# EAGLE design proto1 (EAGLE 9.4.1)
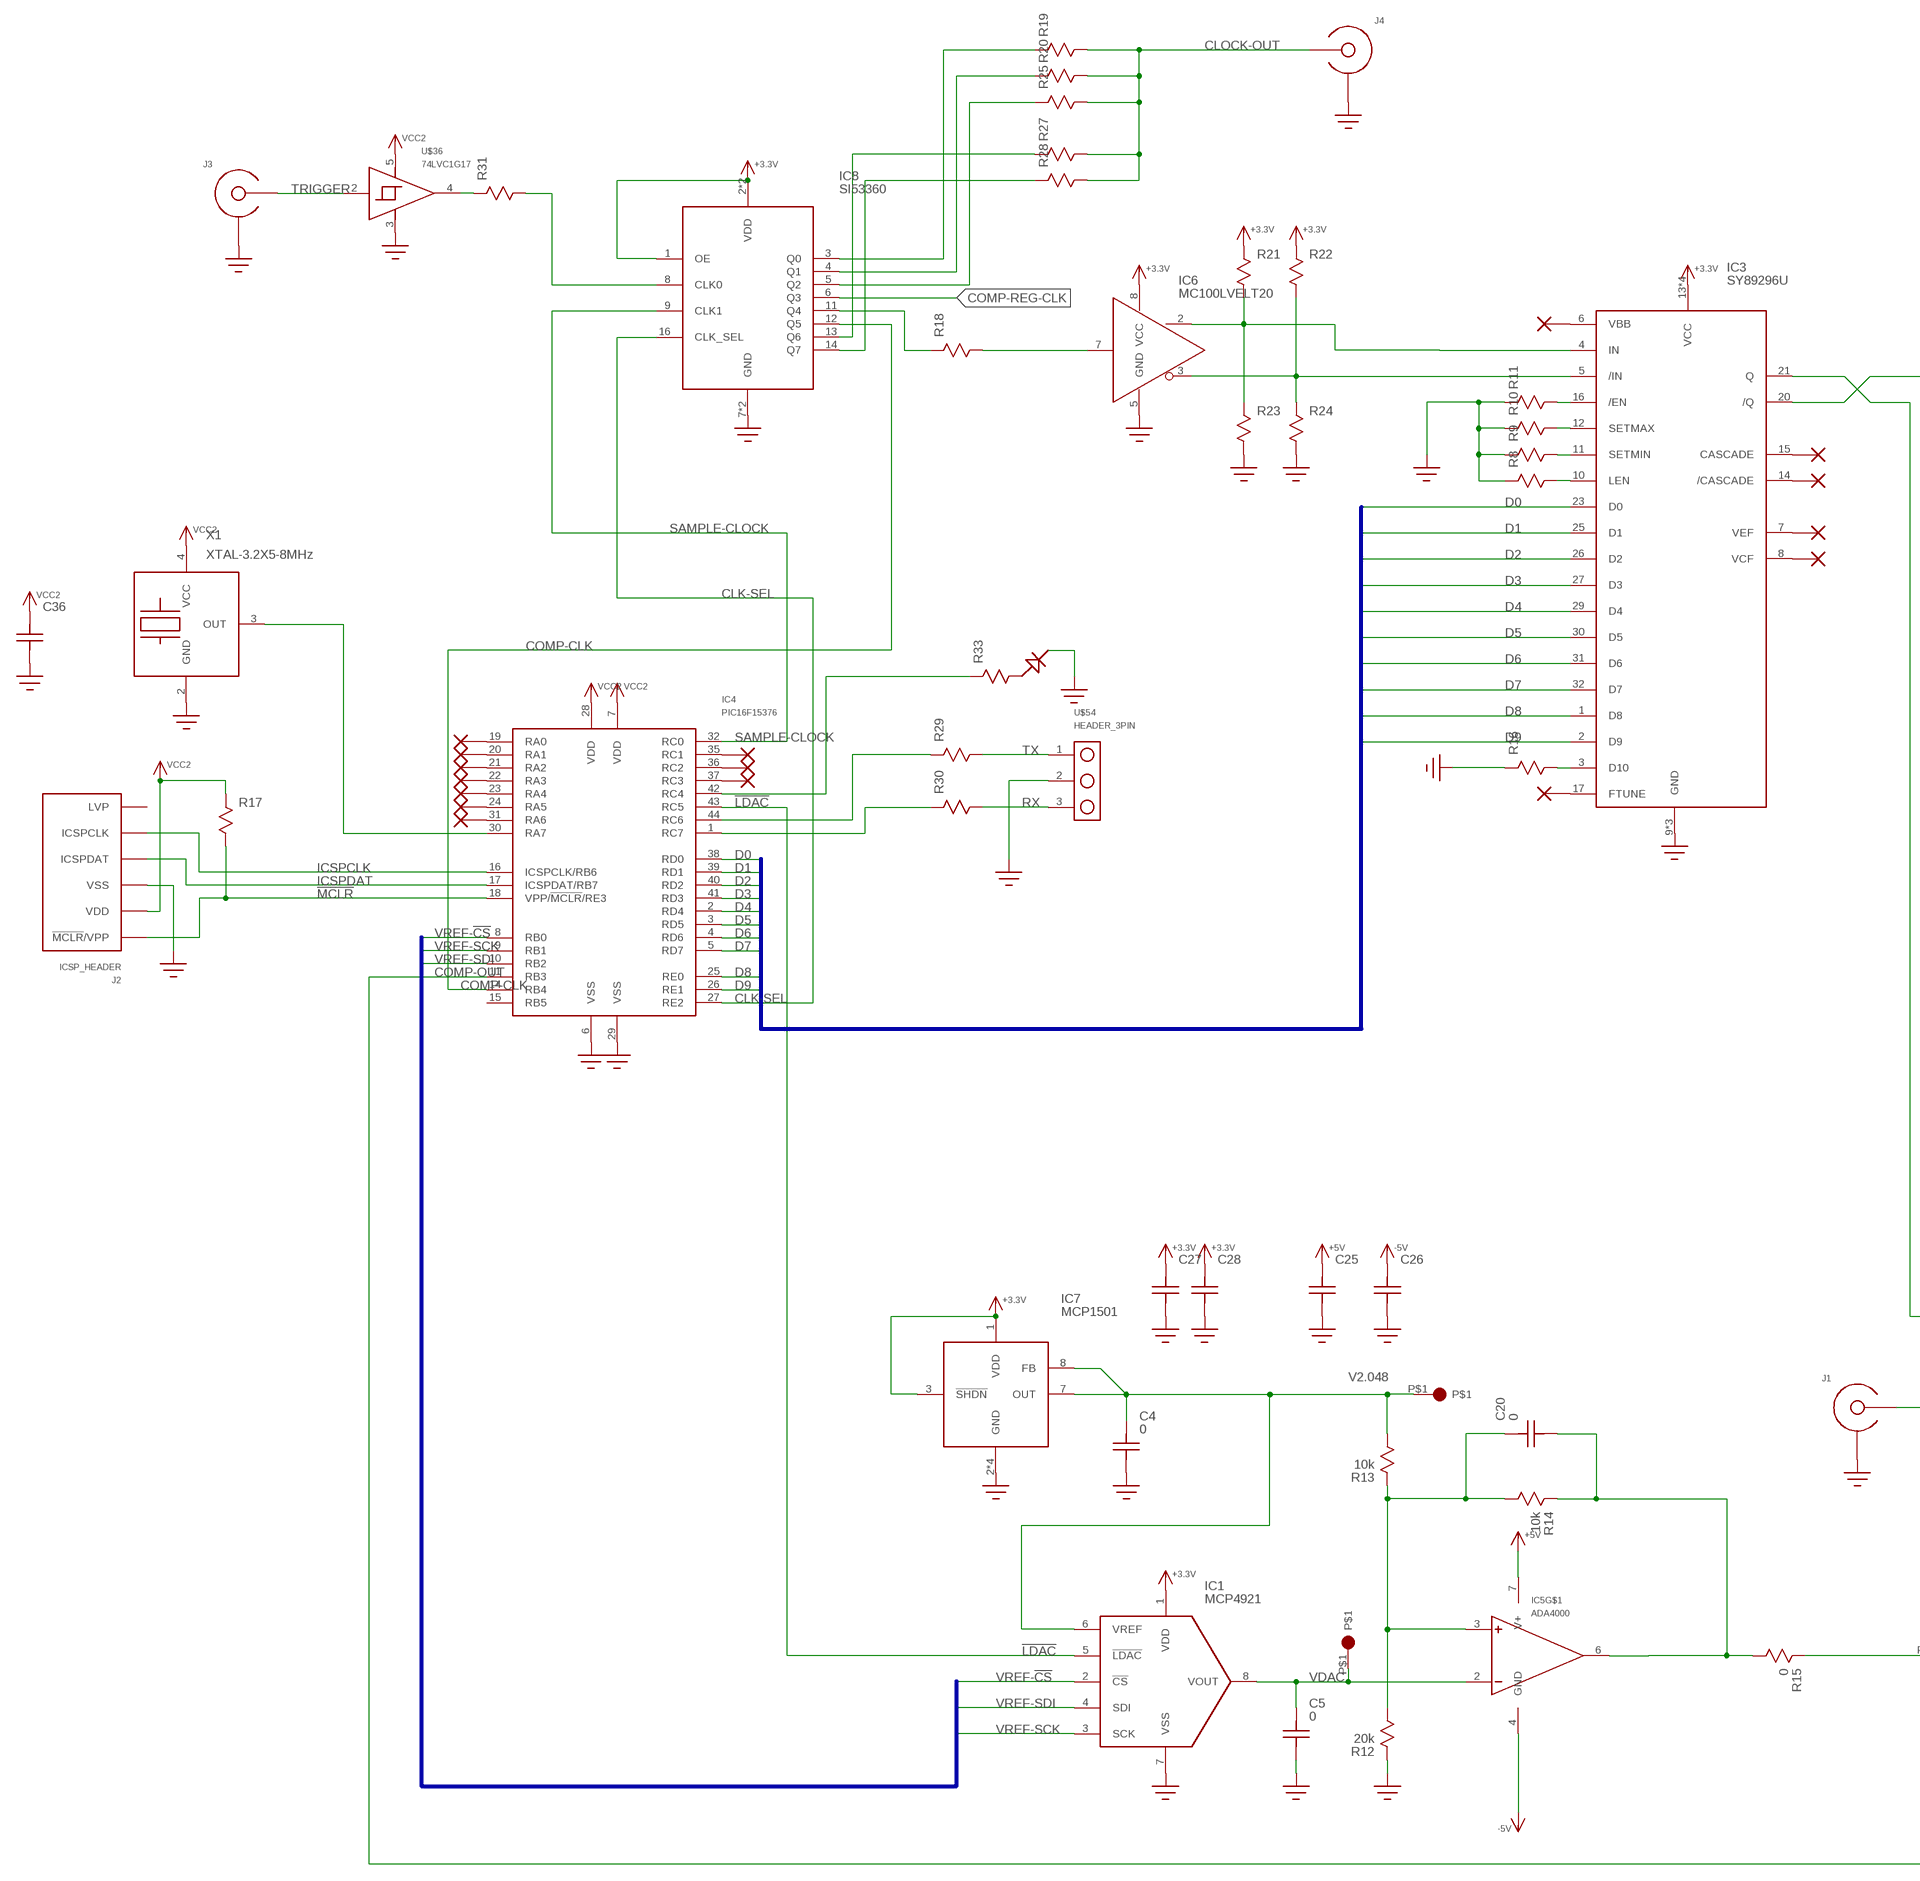
[diagram p0: schematic, sheet 1, part 1 of 2]
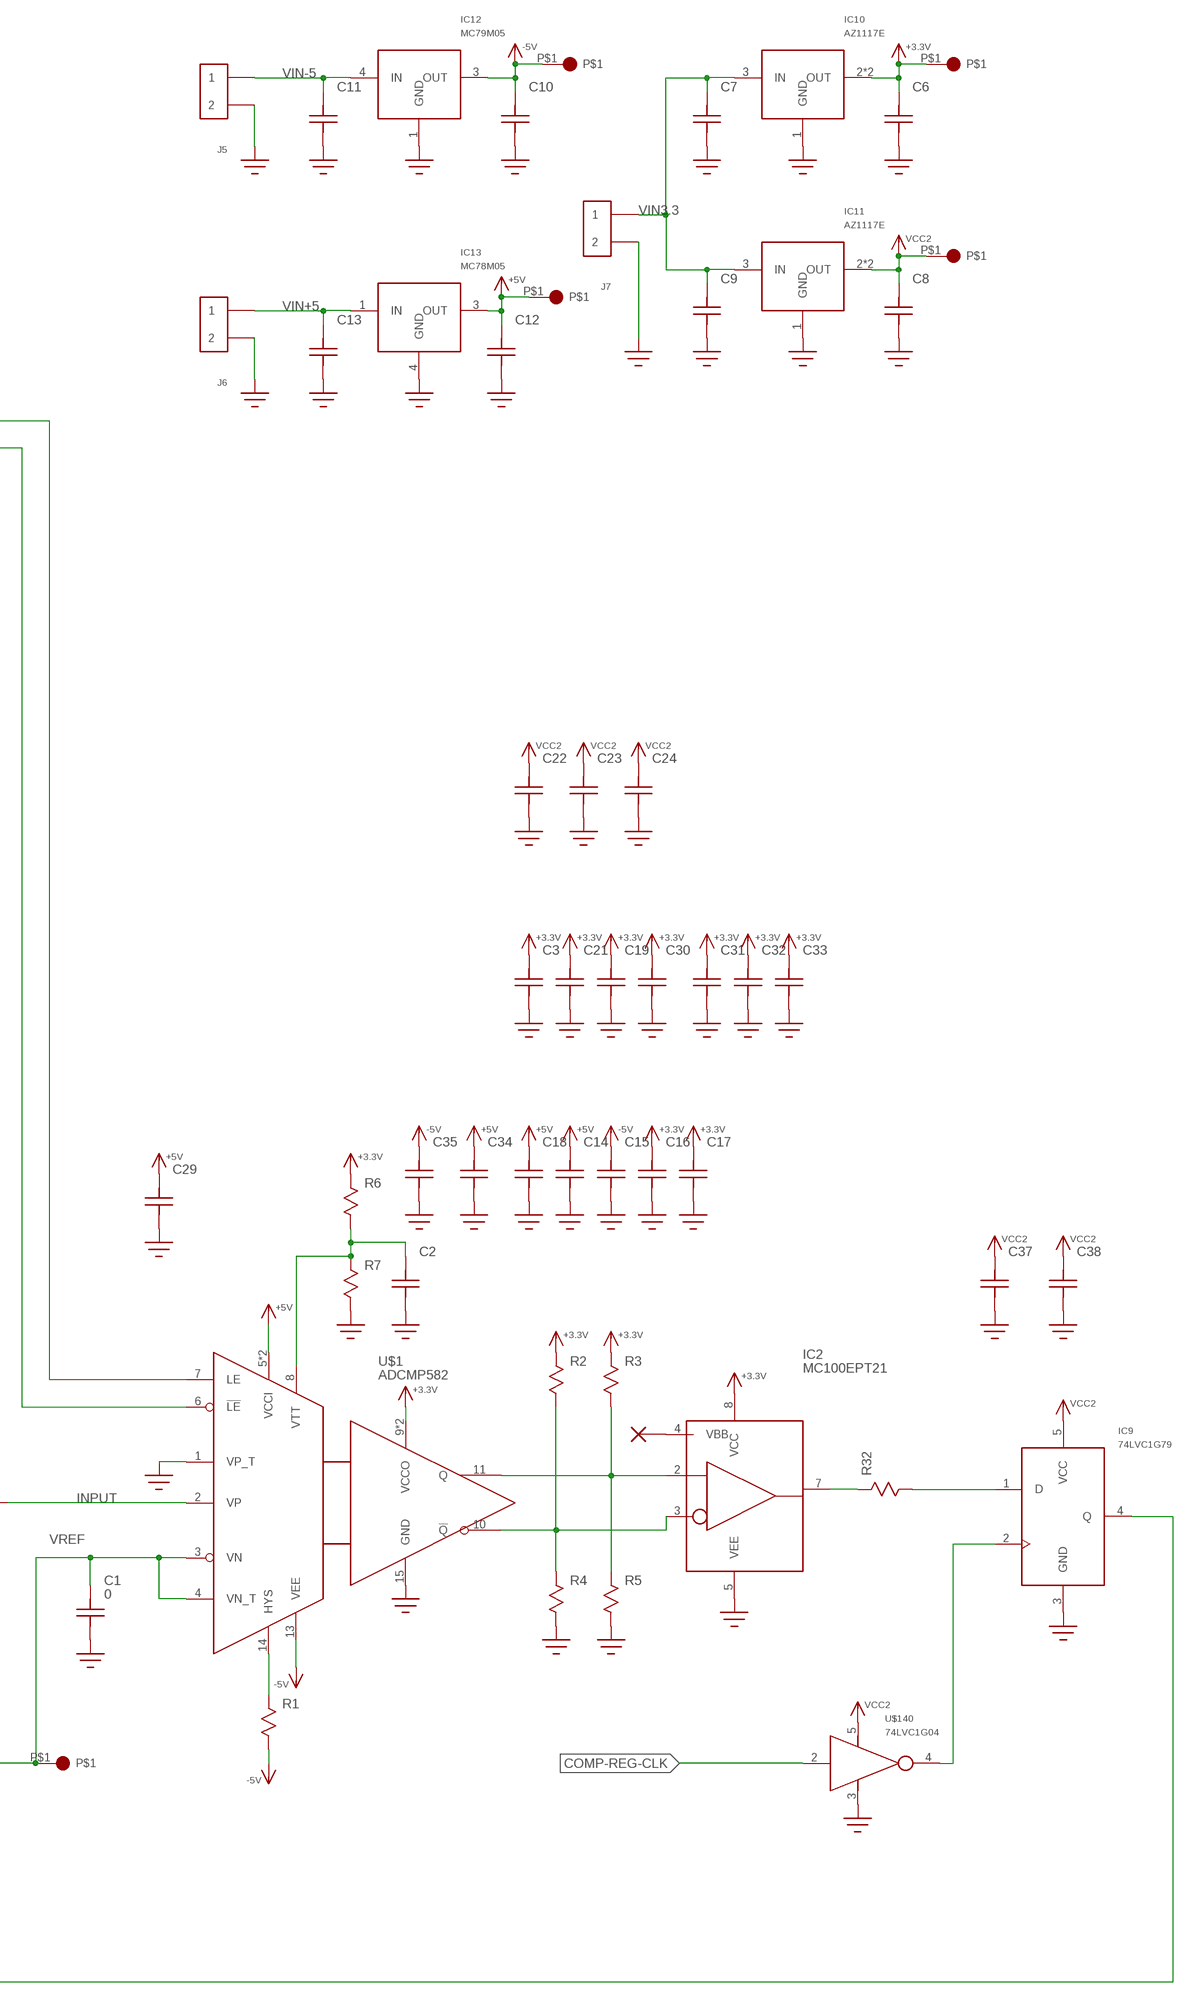
[diagram p1: schematic, sheet 1, part 2 of 2]

## Parts
C1  0  C0603  [C0603]
C2  C0402_NO_THERMALS  [C0402_NO_THERMALS]
C3  C0603  [C0603]
C4  0  C0603  [C0603]
C5  0  C0603  [C0603]
C6  C1206  [1206]
C7  C1206  [1206]
C8  C1206  [1206]
C9  C1206  [1206]
C10  C1206  [1206]
C11  C1206  [1206]
C12  C1206  [1206]
C13  C1206  [1206]
C14  C0402_NO_THERMALS  [C0402_NO_THERMALS]
C15  C0402_NO_THERMALS  [C0402_NO_THERMALS]
C16  C0402_NO_THERMALS  [C0402_NO_THERMALS]
C17  C0402_NO_THERMALS  [C0402_NO_THERMALS]
C18  C0402_NO_THERMALS  [C0402_NO_THERMALS]
C19  C0603  [C0603]
C20  0  C0603  [C0603]
C21  C0603  [C0603]
C22  C0603  [C0603]
C23  C0603  [C0603]
C24  C0603  [C0603]
C25  C0603  [C0603]
C26  C0603  [C0603]
C27  C0603  [C0603]
C28  C0603  [C0603]
C29  C1206  [1206]
C30  C0603  [C0603]
C31  C0603  [C0603]
C32  C0603  [C0603]
C33  C0603  [C0603]
C34  C0603  [C0603]
C35  C0603  [C0603]
C36  C0603  [C0603]
C37  C0603  [C0603]
C38  C0603  [C0603]
IC1  MCP4921  MCP49X1  [SOIC8]
IC2  MC100EPT21  [SOIC8]
IC3  SY89296U  [TQFP32_7X7]
IC4  PIC16F15376  [TQFP44]
IC5  ADA4000  [SOIC8]
IC6  MC100LVELT20  [SOIC8]
IC7  MCP1501  MCP1501SOIC8  [SOIC8]
IC8  SI53360  SI53360TSSOP16  [TSSOP16]
IC9  74LVC1G79  [SOT23-5]
IC10  AZ1117E  [SOT-223]
IC11  AZ1117E  [SOT-223]
IC12  MC79M05  MC79M00  [DPAK]
IC13  MC78M05  MC78M00  [DPAK]
J1  SMA-EDGE-LAUNCH4L-4020-TAPER-FIXED  [SMA_EDGE_LAUNCH_4L_4020_TAPER_FIXED]
J2  ICSP_HEADER  [HEADER_6PIN]
J3  SMA-EDGE-LAUNCH4L-4020-TAPER-FIXED  [SMA_EDGE_LAUNCH_4L_4020_TAPER_FIXED]
J4  SMA-EDGE-LAUNCH4L-4020-TAPER-FIXED  [SMA_EDGE_LAUNCH_4L_4020_TAPER_FIXED]
J5  HEADER_2PINSCREW-TERM  [FCI_20020316_SCREW_TERM_2P]
J6  HEADER_2PINSCREW-TERM  [FCI_20020316_SCREW_TERM_2P]
J7  HEADER_2PINSCREW-TERM  [FCI_20020316_SCREW_TERM_2P]
P1  ICSP_PAD  [ICSP_PAD]
P2  ICSP_PAD  [ICSP_PAD]
P3  ICSP_PAD  [ICSP_PAD]
P4  ICSP_PAD  [ICSP_PAD]
P5  ICSP_PAD  [ICSP_PAD]
P6  ICSP_PAD  [ICSP_PAD]
P7  ICSP_PAD  [ICSP_PAD]
R1  R0603  [R0603]
R2  R0603  [R0603]
R3  R0603  [R0603]
R4  R0603  [R0603]
R5  R0603  [R0603]
R6  R0603  [R0603]
R7  R0603  [R0603]
R8  R0402  [0402]
R9  R0402  [0402]
R10  R0402  [0402]
R11  R0402  [0402]
R12  20k  R0603  [R0603]
R13  10k  R0603  [R0603]
R14  10k  R0603  [R0603]
R15  0  R0603  [R0603]
R16  R0603  [R0603]
R17  R0603  [R0603]
R18  R0603  [R0603]
R19  R0402  [0402]
R20  R0402  [0402]
R21  R0603  [R0603]
R22  R0603  [R0603]
R23  R0603  [R0603]
R24  R0603  [R0603]
R25  R0402  [0402]
R27  R0402  [0402]
R28  R0402  [0402]
R29  R0603  [R0603]
R30  R0603  [R0603]
R31  R0603  [R0603]
R32  R0603  [R0603]
R33  R0603  [R0603]
U$1  ADCMP582  [TQFN16-EP]
U$24  NO_CONNECT  (no package)
U$25  NO_CONNECT  (no package)
U$26  NO_CONNECT  (no package)
U$27  NO_CONNECT  (no package)
U$28  NO_CONNECT  (no package)
U$29  NO_CONNECT  (no package)
U$36  74LVC1G17  [SOT23-5]
U$54  HEADER_3PIN  [HEADER_3PIN]
U$57  NO_CONNECT  (no package)
U$86  NO_CONNECT  (no package)
U$87  NO_CONNECT  (no package)
U$88  LED_0603  [LED_0603]
U$90  NO_CONNECT  (no package)
U$91  NO_CONNECT  (no package)
U$92  NO_CONNECT  (no package)
U$93  NO_CONNECT  (no package)
U$94  NO_CONNECT  (no package)
U$95  NO_CONNECT  (no package)
U$96  NO_CONNECT  (no package)
U$98  NO_CONNECT  (no package)
U$140  74LVC1G04  [SOT23-5]
X1  XTAL-3.2X5-8MHz  XTAL_OSC  [XTAL_3.2X5]

## Nets
!LDAC!: IC1.5(!LDAC!) IC4.43(RC5)
!MCLR!: IC4.18(VPP/!MCLR!/RE3) J2.1(!MCLR!/VPP) R17.P$2
+3.3V: C3.P$2 C6.P$2 C16.2 C17.2 C19.P$2 C21.P$2 C27.P$2 C28.P$2 C30.P$2 C31.P$2 C32.P$2 C33.P$2 IC1.1(VDD) IC2.8(VCC) IC3.13(VCC) IC3.18(VCC) IC3.19(VCC) IC3.22(VCC) IC6.8(VCC) IC7.1(VDD) IC7.3(!SHDN!) IC8.1(OE) IC8.2(VDD) IC8.15(VDD) IC10.2(OUT) IC10.4(OUT) P5.P$1 R2.P$1 R3.P$1 R6.P$1 R21.P$1 R22.P$1 U$1.9(VCCO) U$1.12(VCCO)
+5V: C12.P$2 C14.2 C18.2 C25.P$2 C29.P$2 C34.P$2 IC5.7(V+) IC13.3(OUT) P4.P$1 U$1.5(VCCI) U$1.16(VCCI)
-5V: C10.P$2 C15.2 C26.P$2 C35.P$2 IC5.4(GND) IC12.3(OUT) P3.P$1 R1.P$2 U$1.13(VEE)
CLK-SEL: IC4.27(RE2) IC8.16(CLK_SEL)
CLOCK-OUT: J4.CENTER@1(CENTER) J4.P$3(CENTER) R19.2 R20.2 R25.2 R27.2 R28.2
COMP-CLK: IC4.14(RB4) IC8.12(Q5)
COMP-OUT: IC4.11(RB3) IC9.4(Q)
COMP-REG-CLK: IC8.6(Q3) U$140.2(IN)
D0: IC3.23(D0) IC4.38(RD0)
D1: IC3.25(D1) IC4.39(RD1)
D2: IC3.26(D2) IC4.40(RD2)
D3: IC3.27(D3) IC4.41(RD3)
D4: IC3.29(D4) IC4.2(RD4)
D5: IC3.30(D5) IC4.3(RD5)
D6: IC3.31(D6) IC4.4(RD6)
D7: IC3.32(D7) IC4.5(RD7)
D8: IC3.1(D8) IC4.25(RE0)
D9: IC3.2(D9) IC4.26(RE1)
GND: C1.P$1 C2.1 C3.P$1 C4.P$1 C5.P$1 C6.P$1 C7.P$1 C8.P$1 C9.P$1 C10.P$1 C11.P$1 C12.P$1 C13.P$1 C14.1 C15.1 C16.1 C17.1 C18.1 C19.P$1 C21.P$1 C22.P$1 C23.P$1 C24.P$1 C25.P$1 C26.P$1 C27.P$1 C28.P$1 C29.P$1 C30.P$1 C31.P$1 C32.P$1 C33.P$1 C34.P$1 C35.P$1 C36.P$1 C37.P$1 C38.P$1 IC1.7(VSS) IC2.5(VEE) IC3.9(GND) IC3.24(GND) IC3.28(GND) IC4.6(VSS) IC4.29(VSS) IC6.5(GND) IC7.2(GND) IC7.4(GND) IC7.5(GND) IC7.6(GND) IC8.7(GND) IC8.10(GND) IC9.3(GND) IC10.1(GND) IC11.1(GND) IC12.1(GND) IC13.4(GND) J1.BOTTOM_GND(SHIELD) J1.GND@1(SHIELD) J1.GND@2(SHIELD) J1.GND@3(SHIELD) J1.GND@4(SHIELD) J1.GND@5(SHIELD) J1.GND@6(SHIELD) J1.GND@7(SHIELD) J1.GND@8(SHIELD) J1.GND@14(SHIELD) J1.GND@15(SHIELD) J1.GND@16(SHIELD) J1.GND@17(SHIELD) J1.GND_PAD1(SHIELD) J1.GND_PAD2(SHIELD) J1.P$1(SHIELD) J1.P$2(SHIELD) J2.3(VSS) J3.BOTTOM_GND(SHIELD) J3.GND@1(SHIELD) J3.GND@2(SHIELD) J3.GND@3(SHIELD) J3.GND@4(SHIELD) J3.GND@5(SHIELD) J3.GND@6(SHIELD) J3.GND@7(SHIELD) J3.GND@8(SHIELD) J3.GND@14(SHIELD) J3.GND@15(SHIELD) J3.GND@16(SHIELD) J3.GND@17(SHIELD) J3.GND_PAD1(SHIELD) J3.GND_PAD2(SHIELD) J3.P$1(SHIELD) J3.P$2(SHIELD) J4.BOTTOM_GND(SHIELD) J4.GND@1(SHIELD) J4.GND@2(SHIELD) J4.GND@3(SHIELD) J4.GND@4(SHIELD) J4.GND@5(SHIELD) J4.GND@6(SHIELD) J4.GND@7(SHIELD) J4.GND@8(SHIELD) J4.GND@14(SHIELD) J4.GND@15(SHIELD) J4.GND@16(SHIELD) J4.GND@17(SHIELD) J4.GND_PAD1(SHIELD) J4.GND_PAD2(SHIELD) J4.P$1(SHIELD) J4.P$2(SHIELD) J5.P$2 J6.P$2 J7.P$2 R4.P$2 R5.P$2 R7.P$2 R8.1 R9.1 R10.1 R11.1 R12.P$1 R16.P$1 R23.P$2 R24.P$2 U$1.1(VP_T) U$1.15(GND) U$36.3(GND) U$54.2 U$88.C U$140.3(GND) X1.2(GND)
ICSPCLK: IC4.16(ICSPCLK/RB6) J2.5(ICSPCLK)
ICSPDAT: IC4.17(ICSPDAT/RB7) J2.4(ICSPDAT)
INPUT: J1.CENTER@1(CENTER) J1.P$3(CENTER) U$1.2(VP)
LE_N: IC3.21(Q) U$1.6(!LE!)
LE_P1: IC3.20(/Q) U$1.7(LE)
N$1: R31.P$1 U$36.4(OUT)
N$2: R1.P$1 U$1.14(HYS)
N$3: IC2.2(D) R3.P$2 R5.P$1 U$1.11(Q)
N$4: IC2.3(!D!) R2.P$2 R4.P$1 U$1.10(!Q!)
N$5: C2.2 R6.P$2 R7.P$1 U$1.8(VTT)
N$6: IC3.16(/EN) R11.2
N$7: IC3.12(SETMAX) R10.2
N$8: IC3.11(SETMIN) R9.2
N$9: IC3.10(LEN) R8.2
N$10: IC3.15(CASCADE) U$24.P$1
N$11: IC3.14(/CASCADE) U$25.P$1
N$12: IC3.7(VEF) U$26.P$1
N$13: IC3.8(VCF) U$27.P$1
N$14: IC3.6(VBB) U$28.P$1
N$15: IC2.4(VBB) U$29.P$1
N$16: IC3.4(IN) IC6.2(Q) R21.P$2 R23.P$1
N$17: IC2.7(Q) R32.P$1
N$18: IC8.11(Q4) R18.P$1
N$19: IC9.2(CLK) U$140.4(OUT)
N$20: C20.P$2 IC5.3(+) R12.P$2 R13.P$1 R14.P$2
N$21: C20.P$1 IC5.6(OUT) R14.P$1 R15.P$2
N$22: IC3.5(/IN) IC6.3(!Q!) R22.P$2 R24.P$1
N$23: IC8.8(CLK0) R31.P$2
N$24: IC4.30(RA7) X1.3(OUT)
N$25: IC4.42(RC4) R33.P$1
N$26: R33.P$2 U$88.A
N$27: IC9.1(D) R32.P$2
N$35: IC3.3(D10) R16.P$2
N$36: IC6.7(D) R18.P$2
N$38: IC8.14(Q7) R28.1
N$39: IC8.13(Q6) R27.1
N$41: IC8.5(Q2) R25.1
N$42: IC8.4(Q1) R20.1
N$43: IC8.3(Q0) R19.1
N$44: IC4.44(RC6) R29.P$1
N$45: IC4.1(RC7) R30.P$1
N$47: IC4.35(RC1) U$57.P$1
N$48: IC4.36(RC2) U$86.P$1
N$49: IC4.37(RC3) U$87.P$1
N$52: IC3.17(FTUNE) U$90.P$1
N$53: IC4.19(RA0) U$91.P$1
N$54: IC4.20(RA1) U$92.P$1
N$55: IC4.21(RA2) U$93.P$1
N$56: IC4.22(RA3) U$94.P$1
N$57: IC4.23(RA4) U$95.P$1
N$58: IC4.24(RA5) U$96.P$1
N$60: IC4.31(RA6) U$98.P$1
RX: R30.P$2 U$54.3
SAMPLE-CLOCK: IC4.32(RC0) IC8.9(CLK1)
TRIGGER: J3.CENTER@1(CENTER) J3.P$3(CENTER) U$36.2(IN)
TX: R29.P$2 U$54.1
V2.048: C4.P$2 IC1.6(VREF) IC7.7(OUT) IC7.8(FB) P7.P$1 R13.P$2
VCC2: C8.P$2 C22.P$2 C23.P$2 C24.P$2 C36.P$2 C37.P$2 C38.P$2 IC4.7(VDD) IC4.28(VDD) IC9.5(VCC) IC11.2(OUT) IC11.4(OUT) J2.2(VDD) P6.P$1 R17.P$1 U$36.5(VCC) U$140.5(VCC) X1.4(VCC)
VDAC: C5.P$2 IC1.8(VOUT) IC5.2(-) P2.P$1
VIN3.3: C7.P$2 C9.P$2 IC10.3(IN) IC11.3(IN) J7.P$1
VIN+5: C13.P$2 IC13.1(IN) J6.P$1
VIN-5: C11.P$2 IC12.4(IN) J5.P$1
VREF: C1.P$2 P1.P$1 R15.P$1 U$1.3(VN) U$1.4(VN_T)
VREF-!CS!: IC1.2(!CS!) IC4.8(RB0)
VREF-SCK: IC1.3(SCK) IC4.9(RB1)
VREF-SDI: IC1.4(SDI) IC4.10(RB2)
Unconnected: IC4.15(RB5) J2.6(LVP)

## Buses
D0,D1,D2,D3,D4,D5,D6,D7,D8,D9
VREF-!CS!,VREF-SCK,VREF-SDI

## Library data of the parts
C1-C38 = yapo:C
IC1 = yapo:MCP49X1
IC2 = yapo:MC100EPT21
IC3 = yapo:SY89296U
IC4 = yapo:PIC16F15376
IC5 = yapo:ADA4000
IC6 = yapo:MC100LVELT20
IC7 = yapo:MCP1501
IC8 = yapo:SI53360
IC9 = yapo:74LVC1G79
IC10 IC11 = yapo:AZ1117E
IC12 = yapo:MC79M00
IC13 = yapo:MC78M00
J1 J3 J4 = sma_footprint_2l:SMA-EDGE-LAUNCH
J2 = yapo:ICSP_HEADER
J5-J7 = yapo:HEADER_2PIN
P1-P7 = yapo:ICSP_PAD
R1-R25 R27-R33 = yapo:R
U$1 = yapo:ADCMP582
U$24-U$29 U$57 U$86 U$87 U$90-U$96 U$98 = yapo:NO_CONNECT
U$36 = yapo:74LVC1G17
U$54 = yapo:HEADER_3PIN
U$88 = yapo:LED_0603
U$140 = yapo:74LVC1G04
X1 = yapo:XTAL_OSC

## Net classes
1 diff-pair: width 0.33 mm, clearance 0.203 mm
2 50-ohm: width 0.349 mm

## Board
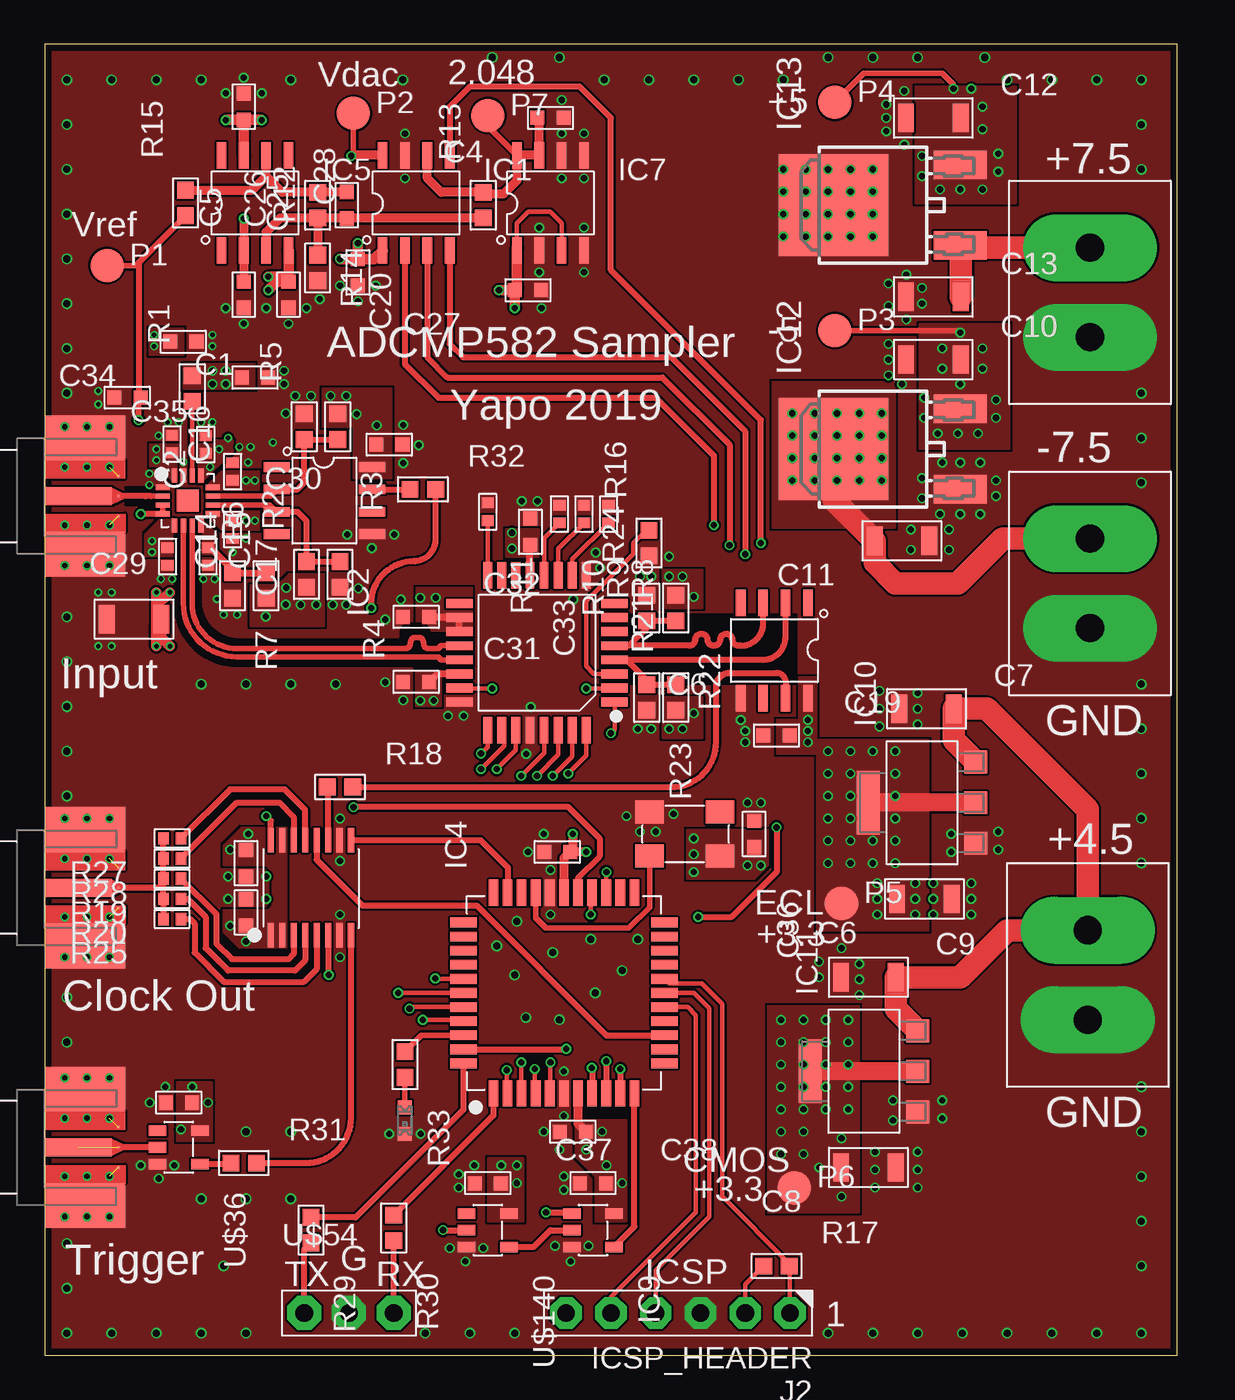
[diagram p2: board, top side]
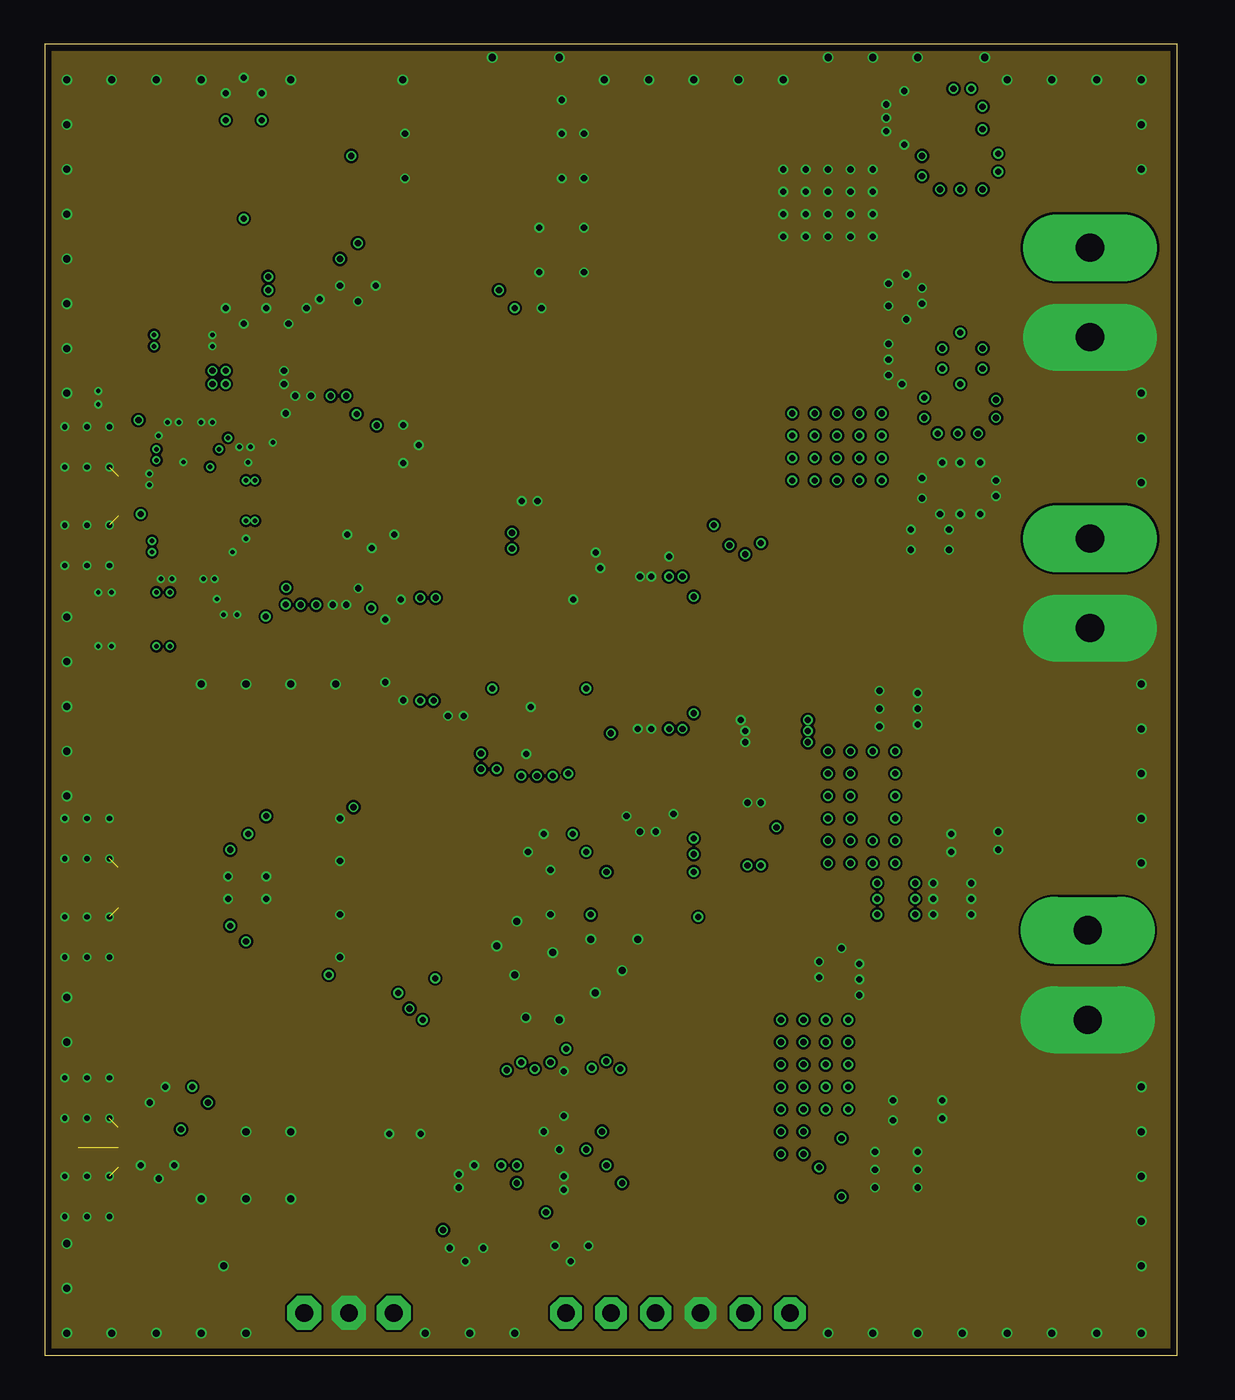
[diagram p3: board, inner layer Route2]
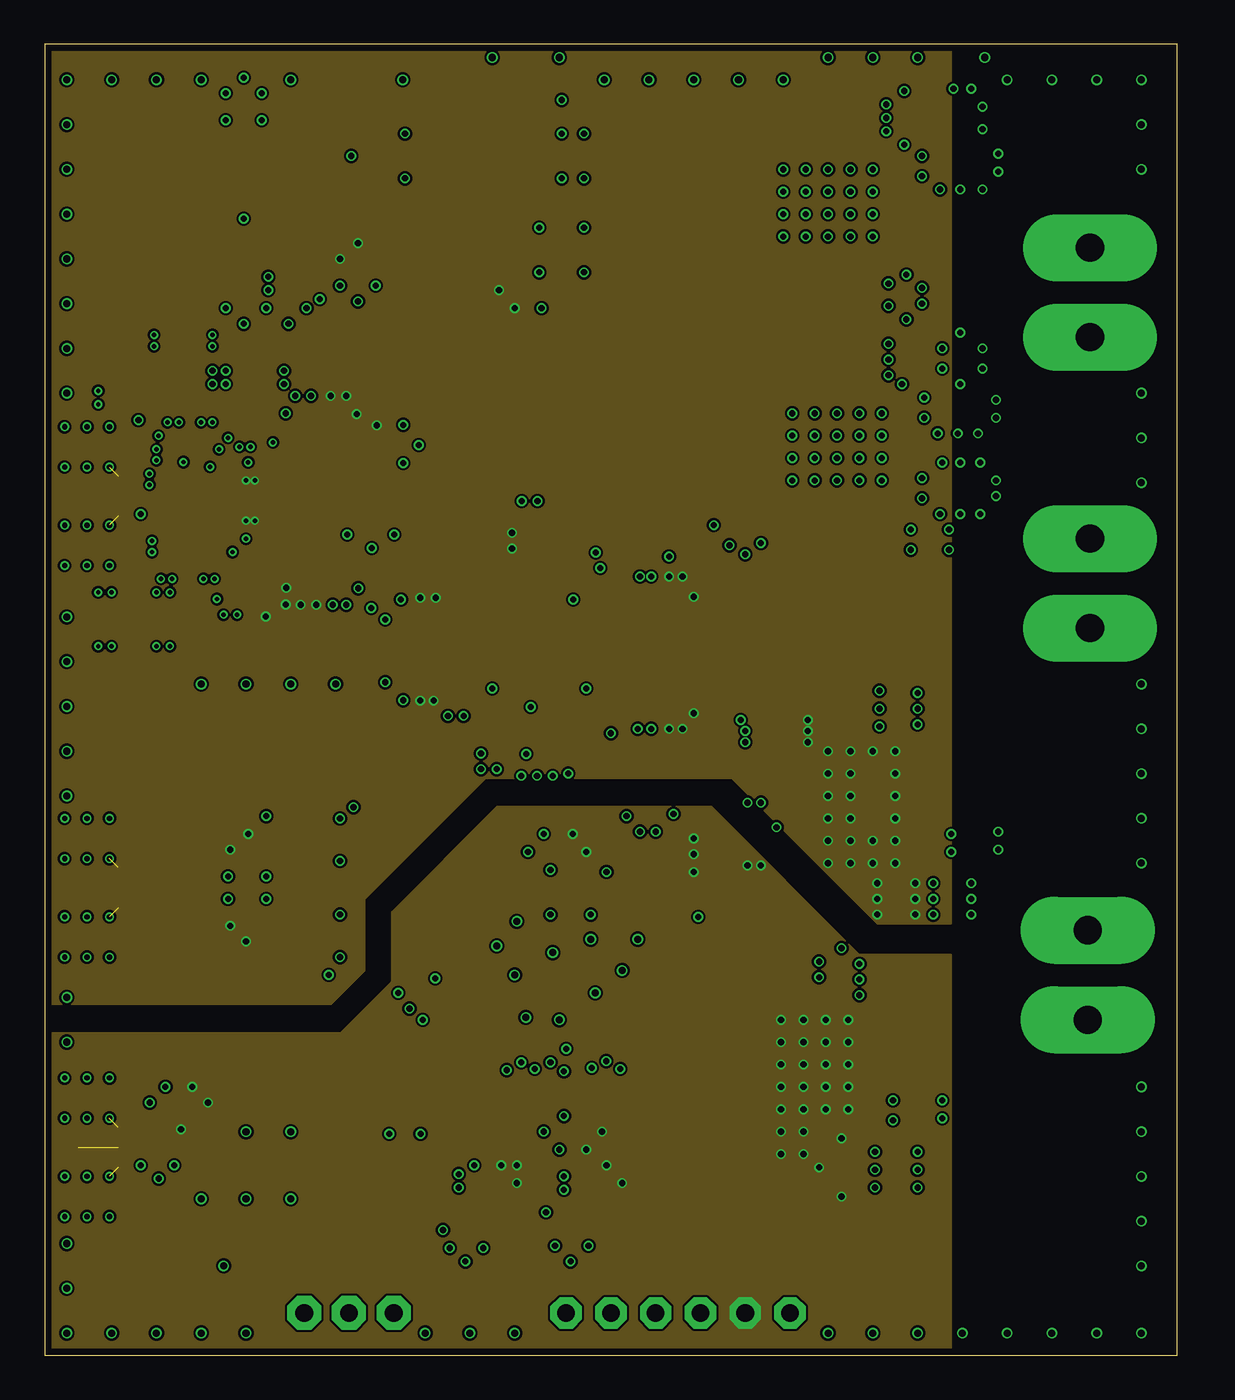
[diagram p4: board, inner layer Route15]
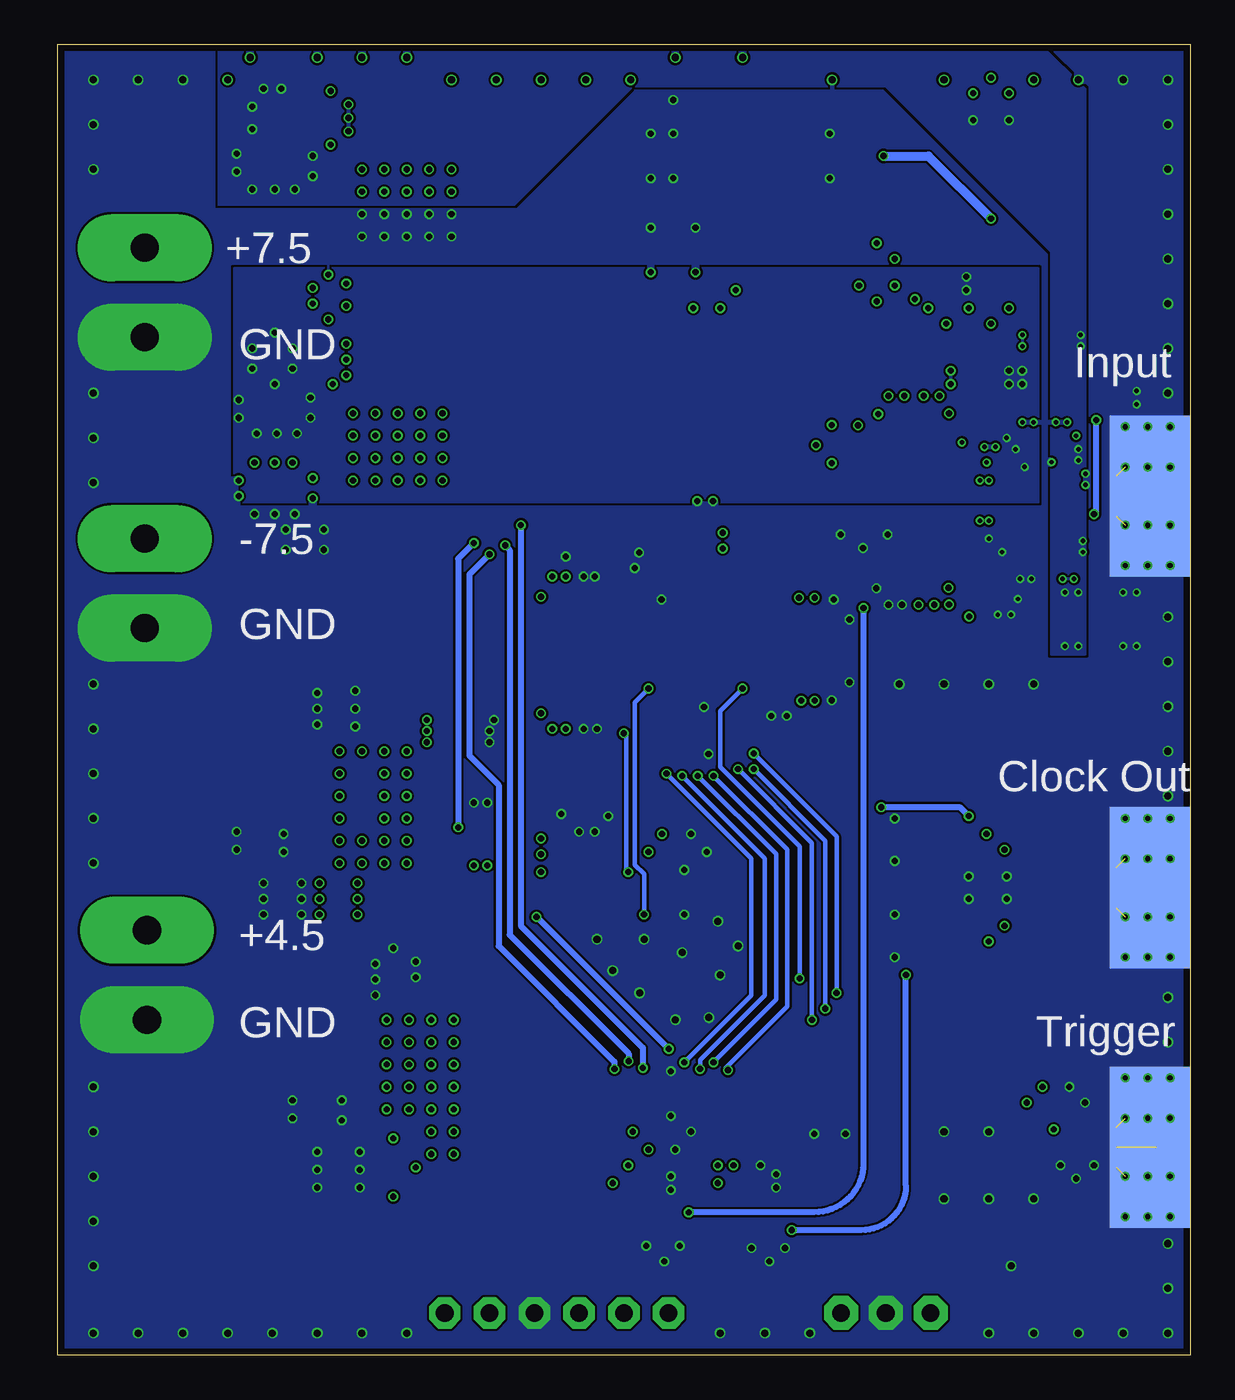
[diagram p5: board, bottom side, seen from below]

Size 64.26 x 74.42 mm. Coordinates in mm from the lower left corner, seen from the top.
Outline: 0,0 64.26,0 64.26,74.42 0,74.42 0,0
Copper layers (1*2*15*16): Top 0.035559375mm / dielectric 0.17018125mm / Route2 0.01778125mm / dielectric 47mil / Route15 0.01778125mm / dielectric 0.17018125mm / Bottom 0.035559375mm
Design rules "oshpark-4layer *": minimum track width 5mil, minimum drill 10mil, track to track 5mil, track to pad 5mil, pad to pad 5mil, via to via 5mil, smd to smd 5mil, copper to edge 15mil, drill to drill 6mil, minimum pad ring 4mil, minimum via ring 4mil, stop-mask expansion 2.5mil, vias tented up to drill 20mil, thermal gap 10mil

### Footprints (pad centres in the part's own frame; a part is rotated, then mirrored left to right if it is on the bottom)
C0603 = smd 0.8 x 0.8: P$1 -0.75,0; P$2 0.75,0
C0402_NO_THERMALS = smd 0.6 x 0.7: 1 -0.5,0; 2 0.5,0
1206 = smd 0.9 x 1.6: P$1 -1.55,0; P$2 1.55,0
SOIC8 = smd 0.55 x 1.5: 1 -1.905,-2.7; 2 -0.635,-2.7; 3 0.635,-2.7; 4 1.905,-2.7; 5 1.905,2.7; 6 0.635,2.7; 7 -0.635,2.7; 8 -1.905,2.7
TQFP32_7X7 = smd 1.5 x 0.5: 1 -4.4,2.8; 2 -4.4,2; 3 -4.4,1.2; 4 -4.4,0.4; 5 -4.4,-0.4; 6 -4.4,-1.2; 7 -4.4,-2; 8 -4.4,-2.8; 17 4.4,-2.8; 18 4.4,-2; 19 4.4,-1.2; 20 4.4,-0.4; 21 4.4,0.4; 22 4.4,1.2; 23 4.4,2; 24 4.4,2.8 | smd 0.5 x 1.5: 9 -2.8,-4.4; 10 -2,-4.4; 11 -1.2,-4.4; 12 -0.4,-4.4; 13 0.4,-4.4; 14 1.2,-4.4; 15 2,-4.4; 16 2.8,-4.4; 25 2.8,4.4; 26 2,4.4; 27 1.2,4.4; 28 0.4,4.4; 29 -0.4,4.4; 30 -1.2,4.4; 31 -2,4.4; 32 -2.8,4.4
TQFP44 = smd 1.5 x 0.55: 1 -5.7,4; 2 -5.7,3.2; 3 -5.7,2.4; 4 -5.7,1.6; 5 -5.7,0.8; 6 -5.7,0; 7 -5.7,-0.8; 8 -5.7,-1.6; 9 -5.7,-2.4; 10 -5.7,-3.2; 11 -5.7,-4; 23 5.7,-4; 24 5.7,-3.2; 25 5.7,-2.4; 26 5.7,-1.6; 27 5.7,-0.8; 28 5.7,0; 29 5.7,0.8; 30 5.7,1.6; 31 5.7,2.4; 32 5.7,3.2; 33 5.7,4 | smd 0.55 x 1.5: 12 -4,-5.7; 13 -3.2,-5.7; 14 -2.4,-5.7; 15 -1.6,-5.7; 16 -0.8,-5.7; 17 0,-5.7; 18 0.8,-5.7; 19 1.6,-5.7; 20 2.4,-5.7; 21 3.2,-5.7; 22 4,-5.7; 34 4,5.7; 35 3.2,5.7; 36 2.4,5.7; 37 1.6,5.7; 38 0.8,5.7; 39 0,5.7; 40 -0.8,5.7; 41 -1.6,5.7; 42 -2.4,5.7; 43 -3.2,5.7; 44 -4,5.7
TSSOP16 = smd 0.35 x 1.4: 1 -2.275,-2.7; 2 -1.625,-2.7; 3 -0.975,-2.7; 4 -0.325,-2.7; 5 0.325,-2.7; 6 0.975,-2.7; 7 1.625,-2.7; 8 2.275,-2.7; 9 2.275,2.7; 10 1.625,2.7; 11 0.975,2.7; 12 0.325,2.7; 13 -0.325,2.7; 14 -0.975,2.7; 15 -1.625,2.7; 16 -2.275,2.7
SOT23-5 = smd 0.6 x 1: 1 -0.95,-1.2; 2 0,-1.2; 3 0.95,-1.2; 4 0.95,1.2; 5 -0.95,1.2
SOT-223 = smd 1.3 x 1.3: 1 -2.3,-3.05; 2 0,-3.05; 3 2.3,-3.05 | smd 3.6 x 1.3: 4 0,3.05
DPAK = smd 1.6 x 3: 1 -2.285,0; 3 2.285,0 | smd 5.8 x 6.2: 4 0,7.18
SMA_EDGE_LAUNCH_4L_4020_TAPER_FIXED = smd 4.572 x 9.144 bottom: BOTTOM_GND 2.286,0 | smd 3.81 x 1.016: CENTER@1 1.905,0 | drill 0.3: GND@1 1.143,3.937; GND@2 3.683,3.937; GND@3 1.143,1.651; GND@4 3.683,1.651; GND@5 1.143,-1.651; GND@6 3.683,-1.651; GND@7 1.143,-3.937; GND@8 3.683,-3.937; GND@14 2.413,3.937; GND@15 2.413,-3.937; GND@16 2.413,-1.651; GND@17 2.413,1.651 | smd 4.572 x 2.54: GND_PAD1 2.286,3.302; GND_PAD2 2.286,-3.302 | smd 0.127 x 0.127: P$1 4.191,1.143; P$2 4.191,-1.143; P$3 4.191,0
HEADER_6PIN = drill 1 pad 1.778 octagon: 1 -6.35,0; 2 -3.81,0; 3 -1.27,0; 4 1.27,0; 5 3.81,0; 6 6.35,0
FCI_20020316_SCREW_TERM_2P = drill 1.6 pad 3.81 long: P$1 -2.54,0; P$2 2.54,0
ICSP_PAD = smd 1.905 x 1.905: P$1 0,0
R0603 = smd 0.95 x 0.95: P$1 -0.725,0; P$2 0.725,0
0402 = smd 0.6 x 0.7: 1 -0.5,0; 2 0.5,0
TQFN16-EP = smd 0.3 x 0.8: 1 -0.75,-1.425; 2 -0.25,-1.425; 3 0.25,-1.425; 4 0.75,-1.425; 9 0.75,1.425; 10 0.25,1.425; 11 -0.25,1.425; 12 -0.75,1.425 | smd 0.8 x 0.3: 5 1.425,-0.75; 6 1.425,-0.25; 7 1.425,0.25; 8 1.425,0.75; 13 -1.425,0.75; 14 -1.425,0.25; 15 -1.425,-0.25; 16 -1.425,-0.75 | smd 1.23 x 1.23: EP 0,0
HEADER_3PIN = drill 1 pad 1.93 octagon: 1 -2.54,0; 2 0,0; 3 2.54,0
LED_0603 = smd 0.8 x 0.8: A -0.75,0; C 0.75,0
XTAL_3.2X5 = smd 1.6 x 1.3: 1 -2,-1.25; 2 2,-1.25; 3 2,1.25; 4 -2,1.25

### Placement (x,y rotation side)
C1  4.7,54.36 0 top
C2  9.27,45.34 90 top
C3  11.43,27.94 90 top
C4  28.7,70.23 180 top
C5  11.3,60.2 90 top
C6  49.91,25.91 180 top
C7  50.04,36.7 0 top
C8  46.74,10.67 180 top
C9  46.74,21.46 0 top
C10  50.42,56.52 0 top
C11  48.64,46.23 180 top
C12  50.42,70.23 0 top
C13  50.42,60.07 0 top
C14  7.24,51.71 270 top
C15  9.14,51.69 270 top
C16  10.67,46.86 90 top
C17  10.67,50.16 270 top
C18  6.99,45.34 90 top
C19  41.53,35.18 0 top
C20  17.14,65.28 270 top
C21  11.43,25.15 270 top
C22  29.08,28.57 0 top
C23  29.97,12.7 0 top
C24  7.62,14.35 0 top
C25  11.3,70.87 270 top
C26  13.84,60.2 90 top
C27  27.43,60.45 180 top
C28  17.78,61.47 90 top
C29  5.08,41.78 0 top
C30  19.56,51.69 180 top
C31  21.08,38.23 0 top
C32  21.08,41.91 0 top
C33  27.56,46.74 270 top
C34  7.87,57.53 180 top
C35  11.94,55.5 180 top
C36  40.26,29.59 270 top
C37  25.15,9.78 0 top
C38  31.11,9.78 0 top
IC1  21.08,65.41 0 top
IC2  15.88,48.51 270 top
IC3  27.94,39.88 180 top
IC4  29.46,20.57 90 top
IC5  11.94,65.41 0 top
IC6  41.4,40.01 180 top
IC7  28.7,65.41 0 top
IC8  15.11,26.54 0 top
IC9  31.11,7.11 270 top
IC10  49.78,31.37 90 top
IC11  46.48,16.13 90 top
IC12  51.94,51.44 90 top
IC13  51.94,65.28 90 top
J1  0,48.77 0 top
J2  35.94,2.41 180 top
J3  0,11.81 0 top
J4  0,26.54 0 top
J5  59.31,43.81 270 top
J6  59.31,60.33 270 top
J7  59.18,21.59 270 top
P1  3.56,61.85 0 top
P2  17.53,70.48 0 top
P3  44.83,58.17 0 top
P4  44.83,71.12 0 top
P5  45.21,25.65 0 top
P6  42.55,9.53 0 top
P7  25.15,70.36 0 top
R1  8.38,54.86 90 top
R2  14.86,44.32 90 top
R3  16.64,52.7 270 top
R4  16.76,44.32 270 top
R5  14.73,52.7 90 top
R6  12.57,43.69 90 top
R7  10.67,43.69 270 top
R8  32,47.75 270 top
R9  30.61,47.75 270 top
R10  29.21,47.75 270 top
R11  25.15,47.88 270 top
R12  15.49,61.72 90 top
R13  24.89,65.28 90 top
R14  15.49,65.28 270 top
R15  8,65.41 90 top
R16  34.29,46.1 90 top
R17  41.53,5.08 0 top
R18  16.76,32.26 0 top
R19  7.24,27.05 180 top
R20  7.24,25.91 180 top
R21  35.81,37.34 90 top
R22  35.81,42.42 270 top
R23  34.16,37.34 270 top
R24  34.16,42.42 90 top
R25  7.24,24.77 180 top
R27  7.24,29.34 180 top
R28  7.24,28.19 180 top
R29  15.11,7.11 270 top
R30  19.81,7.24 270 top
R31  11.3,10.92 0 top
R32  21.46,49.15 0 top
R33  20.45,16.51 270 top
U$1  8.13,48.51 270 top
U$36  7.62,11.81 270 top
U$54  17.27,2.41 0 top
U$88  20.45,13.34 270 top
U$140  25.15,7.11 270 top
X1  36.32,29.59 180 top

### Tracks (layer width: path | path; a pad name or v marks a point on that pad's centre or on a via)
!LDAC!  (via drill 0.35)
  Top 0.349: IC4.43 29.57,17.37 v29.59,17.4 | v41.53,29.97 41.53,27.43 38.99,24.89 v37.08,24.89 | v40.64,46.1 40.64,53.09 32.13,61.59 32.13,70.23 30.35,72.01 24.13,72.01 22.99,70.87 IC1.5
  Bottom 0.349: v40.64,46.1 41.53,45.21 v41.53,29.97 | v37.08,24.89 v29.59,17.4
!MCLR!
  Top 0.254: IC4.18 35.44,21.1 37.29,21.1 38.44,19.95 38.44,9.02 42.25,5.21 R17.P$2 42.29,5.04 J2.1
+3.3V  (via drill 0.25, 0.35)
  Top 0.254: IC7.1 26.8,62.87 26.8,64.26 27.43,64.9 28.7,64.9 29.34,64.26 IC7.3
  Top 0.406: C32.P$2 21.83,41.88 IC3.18 IC3.19 | IC3.22 22.28,38.68 C31.P$2 | IC3.13 27.54,45.97 arc-90 C33.P$2
  Top 0.61: v17.78,63.12 C28.P$2 | v16.76,62.23 16.78,62.22 C28.P$2 | v26.67,59.44 26.68,59.45 C27.P$2 | v25.78,60.45 C27.P$2 | C27.P$2 26.8,60.57 26.8,62.87 | C28.P$2 18.69,62.22 IC1.1
  Top 1.016: IC10.2 IC10.4
  other vias: 11.43,47.37 11.94,47.37 11.43,49.66 11.94,49.66 10.54,28.7 10.54,24.38 11.56,29.59 11.43,23.5 16.23,54.46 17.7,53.42 13.72,43.56 14.53,42.6 12.55,41.94 15.42,42.6 17.12,54.46 13.69,42.62 36.83,43.05 36.2,44.2 35.43,44.2 35.43,35.56 36.2,35.56 36.83,36.45 47.24,26.8 47.24,25.91 47.24,25.02 49.4,26.8 49.4,25.91 49.4,25.02 46.99,34.29 48.26,34.29 48.26,33.02 48.26,31.75 48.26,30.48 48.26,29.21 46.99,29.21 45.72,29.21 44.45,27.94 44.45,30.48 44.45,31.75 44.45,33.02 44.45,34.29 45.72,34.29 45.72,33.02 45.72,31.75 45.72,30.48 44.45,29.21 45.72,27.94 46.99,27.94 48.26,27.94 18.85,52.78 21.31,43 22.2,43 21.31,37.16 22.07,37.16 26.52,46.69 26.52,45.8 43.31,36.07 43.31,35.43 43.31,34.8
  pour Top (no thermals): 9.14,47.88 9.14,47.75 10.03,46.86 12.19,46.86 12.19,47.88
  pour Top (no thermals): 9.14,49.15 12.19,49.15 12.19,50.16 10.03,50.16 9.14,49.28
  pour Top (no thermals): 13.72,23.11 11.05,23.11 10.16,24 10.16,25.27 12.7,25.27 12.95,25.53 12.95,27.43 12.57,27.81 10.16,27.81 10.16,28.96 11.18,29.97 13.72,29.97
  pour Top (no thermals): 11.68,43.69 11.68,41.4 15.88,41.4 15.88,44.32 13.84,44.32 13.21,43.69
  pour Top (no thermals): 35.05,42.42 37.34,42.42 37.34,44.58 35.05,44.58
  pour Top (no thermals): 35.05,37.34 35.05,35.05 37.34,35.05 37.34,37.34
  pour Route15 (no thermals): 51.44,24.51 51.44,74.3 51.56,74.42 0,74.42 0,19.94 16.26,19.94 18.16,21.84 18.16,25.91 25.02,32.77 38.99,32.77 47.24,24.51
  pour Top (no thermals): 50.16,24.77 50.16,34.92 43.81,34.92 43.81,24.13 50.16,24.13
  pour Top (no thermals): 17.65,49.78 19.68,49.78 19.68,54.86 15.75,54.86 15.75,52.7 17.53,52.7 17.53,49.78
  pour Top (no thermals): 21.08,41.15 24.26,41.15 24.26,43.56 21.08,43.56
  pour Top (no thermals): 21.08,38.86 22.48,38.86 22.48,36.83 21.08,36.83
  pour Top (no thermals): 26.29,45.34 28.07,45.34 28.07,46.86 26.16,46.86 26.16,46.74 26.16,45.34
  pour Top (no thermals): 41.53,35.81 41.53,34.16 43.81,34.16 43.81,38.48 42.8,38.48 42.8,36.07 41.53,36.07
+5V  (via drill 0.25, 0.35)
  Top 0.305: P4.P$1 46.48,72.77 50.93,72.77 51.56,72.14 v51.56,71.88
  Top 0.61: IC5.7 C25.P$2 | v12.32,70.1 12.31,70.12 C25.P$2 | v10.29,70.1 10.3,70.12 C25.P$2 | v6.35,40.26 6.35,41.5 | 6.35,41.5 C29.P$2 | v7.11,40.26 6.63,40.74 C29.P$2 | v6.35,43.31 6.35,42.06 C29.P$2 | v7.11,43.31 6.35,42.55 6.35,41.5
  other vias: 6.1,45.59 6.35,51.44 6.1,46.23 6.35,50.8 52.58,71.88 50.8,66.17 51.94,66.17 53.21,66.17 49.78,68.07 49.78,66.93 53.21,70.87 53.21,69.6 54.1,68.2 54.1,67.18 6.22,57.91 6.22,57.28
  pour Top (no thermals): 7.49,47.5 7.49,45.34 5.71,45.34 5.71,46.61 6.6,47.5
  pour Top (no thermals): 7.49,49.66 7.49,50.67 7.62,50.8 7.62,51.69 5.97,51.69 5.97,50.48 6.41,50.48 7.24,49.66
  pour Bottom (no thermals): 5.97,39.75 7.87,39.75 7.87,62.61 17.27,72.01 31.62,72.01 38.35,65.28 55.12,65.28 55.12,74.17 54.86,74.42 8.51,74.42 5.97,71.88
  pour Top (no thermals): 49.4,65.41 55.12,65.41 55.12,72.01 49.53,72.01 49.4,72.01
  pour Top (no thermals): 5.97,58.29 7.87,58.29 7.87,58.17 7.87,56.77 7.75,56.77 5.97,56.77 5.97,58.17
-5V  (via drill 0.25, 0.35)
  Top 0.305: P3.P$1 51.82,58.17 v51.94,58.04
  Top 0.61: IC5.4 C26.P$2 | C26.P$2 13.58,61.21 v12.7,61.21 | v12.7,60.45 13.2,60.95 C26.P$2
  other vias: 9.4,50.42 10.41,52.07 9.53,55.88 9.53,55.12 50.67,52.32 51.82,52.32 52.96,52.32 50.93,57.15 50.93,56.01 53.21,57.15 53.21,56.01 53.98,54.23 53.98,53.21 49.91,54.36 49.91,53.21 51.94,55.12 9.91,51.44 10.29,55.88 10.29,55.12
  pour Top (no thermals): 8.76,49.53 8.76,51.94 10.67,51.94 10.67,51.31 8.89,49.53
  pour Bottom (no thermals): 54.23,51.31 54.23,61.72 9.14,61.72 8.64,61.72 8.64,48.39 54.23,48.39
  pour Top (no thermals): 49.66,51.44 49.66,58.55 54.74,58.55 54.74,51.44
  pour Top (no thermals): 7.87,56.26 7.87,54.86 11.94,54.86 11.94,56.26
CLK-SEL  (via drill 0.35)
  Top 0.33: v17.53,31.11 29.72,31.11 31.5,29.34 31.5,28.32 30.26,27.09 IC4.27
  Top 0.349: IC8.16 12.84,30.34 v12.57,30.61
  Bottom 0.33: v12.57,30.61 13.08,31.11 v17.53,31.11
CLOCK-OUT
  Top 0.127: J4.P$3 J4.CENTER@1
  Top 0.349: R27.2 R28.2 R19.2 6.74,26.55 6.73,26.54 6.74,26.54 | 6.74,26.54 R20.2 R25.2 | 6.74,26.54 J4.CENTER@1
COMP-CLK
  Top 0.349: IC8.12 15.44,28.12 18.03,25.53 24.51,25.53 31.88,18.16 IC4.14
COMP-OUT
  Top 0.349: IC9.4 33.46,7.31 IC4.11
COMP-REG-CLK  (via drill 0.35)
  Top 0.349: v22.61,7.11 U$140.2 | IC8.6 16.09,21.63 v16.13,21.59
  Bottom 0.349: v16.13,21.59 16.13,9.65 arc90 18.67,7.11 v22.61,7.11
D0  (via drill 0.35)
  Top 0.254: IC4.38 22.26,21.37 22.23,21.34 v22.16,21.4 | v25.4,37.85 23.57,37.85 IC3.23
  Bottom 0.254: v22.16,21.4 22.16,28.89 26.67,33.4 26.67,36.58 v25.4,37.85
D1  (via drill 0.35)
  Top 0.254: IC3.25 25.14,34.54 v24.77,34.16 | v20.07,20.57 IC4.39
  Bottom 0.254: v24.77,34.16 20.07,29.46 v20.07,20.57
D2  (via drill 0.35)
  Top 0.254: IC3.26 26.07,35.35 26.07,34.58 v24.77,33.27 | v20.7,19.68 20.79,19.77 IC4.40
  Bottom 0.254: v24.77,33.27 20.7,29.21 v20.7,19.68
D3  (via drill 0.35)
  Top 0.254: IC3.27 26.74,34.36 v25.65,33.27 | v21.46,19.05 23.69,19.05 IC4.41
  Bottom 0.254: v21.46,19.05 21.46,29.08 v25.65,33.27
D4  (via drill 0.35)
  Top 0.254: IC3.29 28.34,34.18 v27.05,32.89 | v26.23,16.19 26.23,14.91 IC4.2
  Bottom 0.254: v27.05,32.89 22.86,28.7 22.86,19.81 26.35,16.32 v26.23,16.19
D5  (via drill 0.35)
  Top 0.254: IC3.30 29.14,34.09 v27.94,32.89 | v27.05,16.64 27.05,14.89 IC4.3
  Bottom 0.254: v27.94,32.89 23.5,28.45 23.5,20.19 v27.05,16.64
D6  (via drill 0.35)
  Top 0.254: IC3.31 29.94,34 v28.83,32.89 | v27.81,16.26 27.81,14.93 IC4.4
  Bottom 0.254: v28.83,32.89 24.13,28.19 24.13,20.45 27.81,16.76 v27.81,16.26
D7  (via drill 0.35)
  Top 0.254: IC3.32 30.74,34.04 v29.72,33.02 | IC4.5 28.7,14.91 v28.7,16.64
  Bottom 0.254: v29.72,33.02 24.89,28.19 24.89,20.45 v28.7,16.64
D8  (via drill 0.35)
  Top 0.254: IC4.25 31.86,27.04 31.88,27.05 v31.88,27.43 | v32.13,35.31 32.34,35.52 IC3.1
  Bottom 0.254: v32.13,35.31 32,35.18 32,27.56 v31.88,27.43
D9  (via drill 0.35)
  Top 0.254: IC3.2 32.31,37.85 v30.73,37.85 | v30.99,25.02 30.99,26.2 IC4.26
  Bottom 0.254: v30.99,25.02 30.99,27.32 31.52,27.85 31.52,37.06 v30.73,37.85
GND  (via drill 0.25, 0.35, 0.4)  (6 unrouted)
  other vias: 9.02,44.07 9.65,44.07 11.43,46.35 9.78,42.93 10.16,42.04 10.92,42.04 3.05,53.98 3.05,54.74 6.6,44.07 7.24,44.07 10.67,45.59 11.56,50.67 11.68,51.56 11.05,51.56 12.95,51.82 8.89,52.96 9.53,52.96 6.99,52.96 7.62,52.96 6.48,52.2 5.94,49.4 5.94,50.04 7.87,50.7 10.41,27.18 10.41,25.91 16.76,28.07 16.76,25.02 16.76,30.48 16.76,22.61 12.57,27.18 12.57,25.91 5.46,10.79 7.37,10.79 6.48,10.03 5.97,14.35 6.86,15.24 28.32,12.7 29.21,11.68 28.32,29.59 27.43,28.57 28.7,27.56 29.46,13.59 29.46,16.13 28.7,25.02 28.07,61.47 28.07,64.01 30.61,64.01 30.61,61.47 30.61,66.8 29.34,66.8 29.34,69.34 30.61,69.34 29.34,71.25 28.19,59.44 17.78,59.82 18.8,60.71 16.76,60.71 20.45,66.8 20.45,69.34 11.3,72.52 12.32,71.63 10.29,71.63 12.57,59.44 13.84,58.55 14.86,59.44 10.29,59.44 11.3,58.55 15.62,59.94 14.22,54.46 13.69,53.47 16.36,42.6 17.81,43.54 17.12,42.6 15.11,54.46 34.42,35.56 33.66,35.56 34.42,44.2 33.78,44.2 35.43,45.34 3.81,43.31 3.05,43.31 3.05,40.26 3.81,40.26 47.75,70.99 47.75,70.23 47.75,69.47 48.77,71.75 48.77,68.71 44.45,66.04 43.18,66.04 45.72,66.04 45.72,64.77 44.45,64.77 43.18,64.77 43.18,63.5 44.45,63.5 45.72,63.5 45.72,67.31 44.45,67.31 43.18,67.31 41.91,67.31 41.91,66.04 41.91,64.77 41.91,63.5 46.99,67.31 46.99,66.04 46.99,64.77 46.99,63.5 49.53,37.59 49.53,36.7 49.53,35.81 47.37,37.72 47.37,36.7 47.37,35.69 52.58,26.8 52.58,25.91 52.58,25.02 50.42,26.8 50.42,25.91 50.42,25.02 54.1,29.72 54.1,28.7 51.44,29.59 51.44,28.57 17.17,46.58 19.84,46.58 18.57,45.82 20.35,52.81 20.35,50.65 21.23,51.66 20.35,37.19 20.22,42.9 19.33,38.2 19.33,41.76 27.08,48.49 27.97,48.49 22.89,36.3 23.77,36.3 30,42.9 31.52,44.68 31.27,45.57 27.33,34.14 27.58,36.8 48.9,61.34 49.78,60.58 49.78,59.69 48.9,58.8 47.88,60.83 47.88,59.56 47.88,56.52 47.88,55.63 48.64,55.12 47.88,57.4 53.98,49.66 53.98,48.77 49.78,49.78 49.78,48.64 50.93,50.67 51.94,50.67 53.09,50.67 50.8,47.75 51.94,47.75 53.09,47.75 49.15,46.86 49.15,45.72 51.31,46.86 51.31,45.72 46.23,22.23 46.23,21.34 46.23,20.45 45.21,23.11 43.94,22.35 43.94,21.46 50.93,14.48 50.93,13.46 48.13,14.48 48.13,13.34 49.53,11.56 49.53,10.54 49.53,9.53 47.12,11.56 47.12,10.54 47.12,9.53 9.53,57.91 9.53,57.28 13.59,55.88 13.59,55.12 33.02,30.61 35.69,30.73 33.78,29.72 34.67,29.72 39.88,31.37 40.64,31.37 19.56,12.57 21.34,12.57 39.5,36.07 39.75,35.43 39.75,34.8 30.86,6.22 28.96,6.22 29.84,5.33 24.89,6.1 22.99,6.1 23.88,5.33 24.38,10.79 23.5,10.29 23.5,9.53 29.46,10.16 29.46,9.4 10.16,5.08 1.27,1.27 3.81,1.27 6.35,1.27 8.89,1.27 11.43,1.27 21.59,1.27 24.13,1.27 26.67,1.27 44.45,1.27 46.99,1.27 49.53,1.27 52.07,1.27 54.61,1.27 57.15,1.27 59.69,1.27 62.23,1.27 1.27,3.81 1.27,6.35 1.27,17.78 1.27,20.32 1.27,31.75 1.27,34.29 1.27,36.83 1.27,39.37 1.27,41.91 1.27,54.61 1.27,57.15 1.27,59.69 1.27,62.23 1.27,64.77 1.27,67.31 1.27,69.85 1.27,72.39 3.81,72.39 6.35,72.39 8.89,72.39 13.97,72.39 20.32,72.39 31.75,72.39 34.29,72.39 36.83,72.39 39.37,72.39 41.91,72.39 29.21,73.66 25.4,73.66 44.45,73.66 46.99,73.66 49.53,73.66 53.34,73.66 54.61,72.39 57.15,72.39 59.69,72.39 62.23,72.39 62.23,69.85 62.23,67.31 62.23,54.61 62.23,52.07 62.23,49.53 62.23,38.1 62.23,35.56 62.23,33.02 62.23,30.48 62.23,27.94 62.23,15.24 62.23,12.7 62.23,10.16 62.23,7.62 62.23,5.08 16.51,38.1 13.97,38.1 11.43,38.1 8.89,38.1 8.89,8.89 11.43,8.89 11.43,12.7 13.97,12.7 13.97,8.89 28.83,22.86 29.21,19.05 26.67,21.59 31.24,20.57 26.8,24.64 33.66,23.62 32.77,21.84 30.99,23.62 25.65,23.24 27.3,19.18
  pour Top (rank 2, no thermals): 0,0 64.26,0 64.26,74.42 0,74.42
  pour Route2 (no thermals): 0,0 0,74.42 64.26,74.42 64.26,0
  cutout Top (no thermals): 7.37,47.37 7.37,42.67 arc90 10.92,39.12 24.38,39.12 24.38,40.77 22.1,40.77 arc-90 21.84,41.02 arc90 21.34,41.53 20.7,41.53 arc90 20.19,41.02 20.19,40.77 arc-90 20.07,40.64 11.05,40.64 arc-90 8.89,42.8 8.89,47.24 arc90 8.64,47.5 7.49,47.5 arc90
  cutout Top (no thermals): 31.5,42.04 31.5,38.1 42.67,38.1 42.67,42.04
  cutout Top (no thermals): 4.57,49.28 4.57,48.26 7.11,48.26 7.11,49.28
  pour Bottom (rank 2, no thermals): 0,0 64.26,0 64.26,74.42 0,74.42
ICSPCLK
  Top 0.254: IC4.16 36.49,19.77 36.96,19.3 36.96,8.13 32.13,3.3 J2.5
ICSPDAT
  Top 0.254: IC4.17 36.83,20.57 37.72,19.68 37.72,7.87 34.67,4.83 J2.4
INPUT
  Top 0.305: U$1.2 6.05,48.76 6.04,48.77 | J1.P$3 5.71,48.77
  Top 0.349: 6.04,48.77 5.71,48.77 J1.CENTER@1
LE_N
  Top 0.305: IC3.21 22.5,39.48 22.33,39.65 10.9,39.65 arc-90 7.88,42.67 U$1.6
LE_P1
  Top 0.305: IC3.20 22.5,40.28 22.33,40.11 21.81,40.11 arc-90 21.5,40.42 21.5,40.44 arc90 21.19,40.75 21.07,40.75 arc90 20.76,40.44 20.76,40.42 arc-90 20.45,40.11 10.94,40.11 arc-90 8.38,42.67 U$1.7
N$1
  Top 0.349: U$36.4 10.52,10.86 arc90 R31.P$1
N$2
  Top 0.254: U$1.14 R1.P$1
N$3
  Top 0.305: U$1.11 12.79,48.77 IC2.2
  Top 0.349: R3.P$2 R5.P$1 14.73,49.53 14.35,49.15 IC2.2
N$4
  Top 0.305: U$1.10 12.79,48.26 IC2.3
  Top 0.349: IC2.3 14.35,47.88 14.73,47.5 14.86,47.37 R2.P$2 R4.P$1
N$5
  Top 0.406: R6.P$2 R7.P$1 10.67,44.56 9.39,45.84 C2.2
  pour Top (no thermals): 8.76,47.5 8.76,45.47 9.78,45.47 9.78,46.61 8.89,47.5
N$6
  Top 0.254: IC3.16 R11.2
N$7
  Top 0.254: IC3.12 28.34,46.38 R10.2
N$8
  Top 0.254: IC3.11 29.14,45.78 R9.2
N$9
  Top 0.254: IC3.10 29.94,45.19 R8.2
N$16
  Top 0.349: 33.02,39.48 40.75,39.48 arc90 42.04,40.77 IC6.2 | 33.02,39.48 IC3.4 | 33.02,39.48 34.16,38.34 R23.P$1 R21.P$2
N$17
  Top 0.349: IC2.7 R32.P$1
N$18
  Top 0.349: IC8.11 16.09,32.21 R18.P$1
N$19
  Top 0.349: U$140.4 27.75,6.16 28.7,7.11 IC9.2
N$20
  Top 0.508: R13.P$1 17.17,64.55 C20.P$2 15.52,64.53 R14.P$2 | R14.P$2 13.37,64.55 12.57,63.75 IC5.3 | R14.P$2 R12.P$2
N$21
  Top 0.508: C20.P$1 15.52,66.03 R14.P$1 13.5,66 12.57,66.93 | 12.57,66.93 IC5.6 | R15.P$2 11.77,66.13 12.57,66.93
N$22
  Top 0.349: 33.15,40.28 36.58,40.28 arc90 36.91,40.61 arc-90 37.24,40.95 37.28,40.95 arc-90 37.62,40.61 arc90 37.95,40.28 37.99,40.28 arc90 38.32,40.61 arc-90 38.66,40.95 38.7,40.95 arc-90 39.03,40.61 arc90 39.36,40.28 39.52,40.28 arc90 40.77,41.53 IC6.3 | 33.15,40.28 IC3.5 | 33.15,40.28 34.16,41.29 R24.P$1 R22.P$2
N$23
  Top 0.349: R31.P$2 14.85,10.92 arc90 17.39,13.46 IC8.8
N$24
  Top 0.305: X1.3 34.32,25.43 33.15,24.26 28.45,24.26 27.86,24.84 IC4.30
N$25
  Top 0.305: IC4.42 21.39,18.17 R33.P$1
N$26
  Top 0.305: R33.P$2 U$88.A
N$27  (via drill 0.35)
  Top 0.349: v28.45,8.13 29.85,8.13 arc-90 IC9.1 | v18.54,42.42 18.54,42.67 arc-90 20.95,45.09 arc90 22.19,46.32 R32.P$2
  Bottom 0.349: v18.54,42.42 18.54,10.92 arc90 21.34,8.13 v28.45,8.13
N$35
  Top 0.254: IC3.3 31.17,38.68 30.73,39.12 30.73,42.8 33.4,45.47 33.4,46.1 34.13,46.83 R16.P$2
N$36
  Top 0.349: R18.P$2 35.56,32.26 arc90 38.1,34.8 38.1,37.97 arc-90 38.86,38.73 41.53,38.73 arc-90 42.04,38.23 IC6.7
N$38
  Top 0.349: R28.1 10.91,31.37 13.34,31.37 14.14,30.57 IC8.14
N$39
  Top 0.349: R27.1 10.53,32.13 13.63,32.13 14.79,30.97 IC8.13
N$41
  Top 0.349: IC8.5 15.44,21.91 14.73,21.21 10.16,21.21 8.51,22.86 8.51,24.51 8.26,24.77 R25.1
N$42
  Top 0.349: IC8.4 14.79,22.41 14.22,21.84 10.41,21.84 9.14,23.11 9.14,24.89 8.13,25.91 R20.1
N$43
  Top 0.349: IC8.3 14.14,22.77 13.84,22.48 10.64,22.48 9.75,23.37 9.75,25.04 R19.1
N$44
  Top 0.349: IC4.44 23.76,13.95 17.65,7.84 R29.P$1
N$45
  Top 0.349: IC4.1 25.46,13.62 R30.P$1
RX
  Top 0.349: U$54.3 R30.P$2
SAMPLE-CLOCK
  Top 0.349: IC8.9 24.73,29.24 26.29,27.69 26.29,26.3 IC4.32
TRIGGER  (1 unrouted)
  Top 0.349: U$36.2 J3.P$3
TX
  Top 0.349: U$54.1 14.73,6.01 R29.P$2
V2.048
  Top 0.305: P7.P$1 25.15,69.76 IC7.8
  Top 0.508: C4.P$2 28.07,70.12 IC7.7 IC7.8 26.8,66.67 26.04,65.91 24.98,65.91 R13.P$2 22.52,66 21.72,66.8 IC1.6
VCC2  (via drill 0.35)
  Top 0.254: R17.P$1 39.75,4.03 J2.2
  Top 0.508: IC4.7 30.26,13.16 C23.P$2 | IC4.28 29.46,28.21 C22.P$2 29.97,28.71 | v29.97,29.59 29.97,28.71 | v30.73,28.57 30.11,28.57 29.97,28.71
  Top 1.016: IC11.2 IC11.4
  other vias: 9.27,14.35 8.38,15.24 7.75,12.83 31.62,12.7 41.78,17.78 43.05,17.78 44.32,17.78 41.78,16.51 43.05,16.51 44.32,16.51 44.32,15.24 43.05,15.24 41.78,15.24 41.78,13.97 43.05,13.97 44.32,13.97 44.32,19.05 43.05,19.05 41.78,19.05 45.59,19.05 45.59,17.78 45.59,16.51 45.59,15.24 45.59,13.97 41.78,12.7 43.05,12.7 43.05,11.43 41.78,11.43 45.21,12.32 45.21,9.02 43.94,10.67 36.83,28.45 36.83,27.43 40.64,27.81 36.83,29.34 30.73,11.68 31.88,10.79 32.77,9.78 25.91,10.79 26.8,9.78 26.8,10.79 39.88,27.81
  pour Top (no thermals): 7.49,15.49 7.49,12.19 9.53,12.19 9.53,15.49
  pour Route15 (no thermals): 0,0 51.44,0 51.44,22.73 46.23,22.73 37.85,31.11 25.65,31.11 19.68,25.15 19.68,21.21 16.76,18.29 0,18.29
  pour Top (no thermals): 46.23,9.02 46.23,19.81 41.02,19.81 41.02,8.13 41.27,8.13 46.23,8.13
  pour Top (no thermals): 36.45,29.84 41.02,29.84 41.02,28.96 41.02,27.81 40.26,27.05 36.45,27.05
  pour Top (no thermals): 31.24,7.62 33.02,7.62 33.02,13.34 30.1,13.34 30.1,11.3 31.24,10.16
  pour Top (no thermals): 25.15,11.18 25.15,7.62 27.18,7.62 27.18,11.18
VDAC  (via drill 0.35)
  Top 0.305: P2.P$1 17.53,68.2 17.43,68.11
  Top 0.508: C5.P$2 IC5.2 v11.3,64.52 | IC1.8 17.43,68.11 v17.4,68.07
  Bottom 0.508: v17.4,68.07 14.86,68.07 v11.3,64.52
VIN3.3
  Top 1.27: IC10.3 51.59,34.91 C7.P$2 53.47,36.7 59.18,30.99 J7.P$1 54.61,24.13 51.94,21.46 C9.P$2 48.29,19.68 IC11.3
VIN+5
  Top 1.27: J6.P$1 52.07,62.87 IC13.1 51.97,62.97 C13.P$2
VIN-5  (via drill 0.35)
  Top 1.27: J5.P$1 54.36,46.35 51.82,43.81 48.26,43.81 47.09,44.98 C11.P$2 44.76,48.56 IC12.4
  other vias: 46.23,53.47 44.96,53.47 43.69,53.47 42.42,53.47 42.42,52.2 43.69,52.2 44.96,52.2 46.23,52.2 46.23,50.93 44.96,50.93 43.69,50.93 42.42,50.93 42.42,49.66 43.69,49.66 44.96,49.66 46.23,49.66 47.5,53.47 47.5,52.2 47.5,50.93 47.5,49.66
  pour Top (no thermals): 41.27,55.24 41.27,46.99 48.26,46.99 48.26,55.24
VREF  (via drill 0.35)
  Top 0.305: U$1.4 U$1.3 | P1.P$1 5.17,61.85 5.33,62.01
  Top 0.349: v5.33,53.09 5.33,54.24 | 5.33,54.24 C1.P$2 | R15.P$1 5.33,62.01 5.33,54.24 | U$1.4 v5.46,47.75
  Bottom 0.349: v5.46,47.75 5.33,47.88 v5.33,53.09
VREF-!CS!  (via drill 0.35)
  Top 0.349: IC1.2 20.45,56.26 22.35,54.36 34.67,54.36 37.97,51.05 v37.97,47.12 | v31.05,16.32 31.06,16.31 IC4.8
  Bottom 0.349: v37.97,47.12 37.97,24.38 31.05,17.46 v31.05,16.32
VREF-SCK  (via drill 0.35)
  Top 0.349: IC1.3 21.72,56.64 22.86,55.5 35.05,55.5 38.86,51.69 v38.86,45.97 | v31.86,16.7 IC4.9 | IC4.9
  Bottom 0.349: v38.86,45.97 38.61,45.72 38.61,23.88 31.86,17.13 v31.86,16.7
VREF-SDI  (via drill 0.35)
  Top 0.349: IC1.4 22.99,57.4 23.75,56.64 35.56,56.64 39.75,52.45 v39.75,45.47 | IC4.10 | v32.66,16.26 IC4.10
  Bottom 0.349: v39.75,45.47 40.89,44.32 40.89,34.04 39.24,32.38 39.24,23.24 32.66,16.66 v32.66,16.26

### Text on the board
tPlace: Vdac | 2.048 | +5 | +7.5 | Vref | -5 | ADCMP582 Sampler | Yapo 2019 | -7.5 | Input | GND | +4.5 | ECL | +3.3 | Clock Out | GND | CMOS | +3.3 | Trigger | G | TX | RX | ICSP | 1
bPlace: +7.5 | GND | Input | -7.5 | GND | Clock Out | +4.5 | Trigger | GND